# EAGLE schematic Mainboard (EAGLE 7.7.0)
AUTHOR: Eltra EW; DESCRIPION: test; DESCRIPTION: Platine an Schlitten; VERSION: V1.0
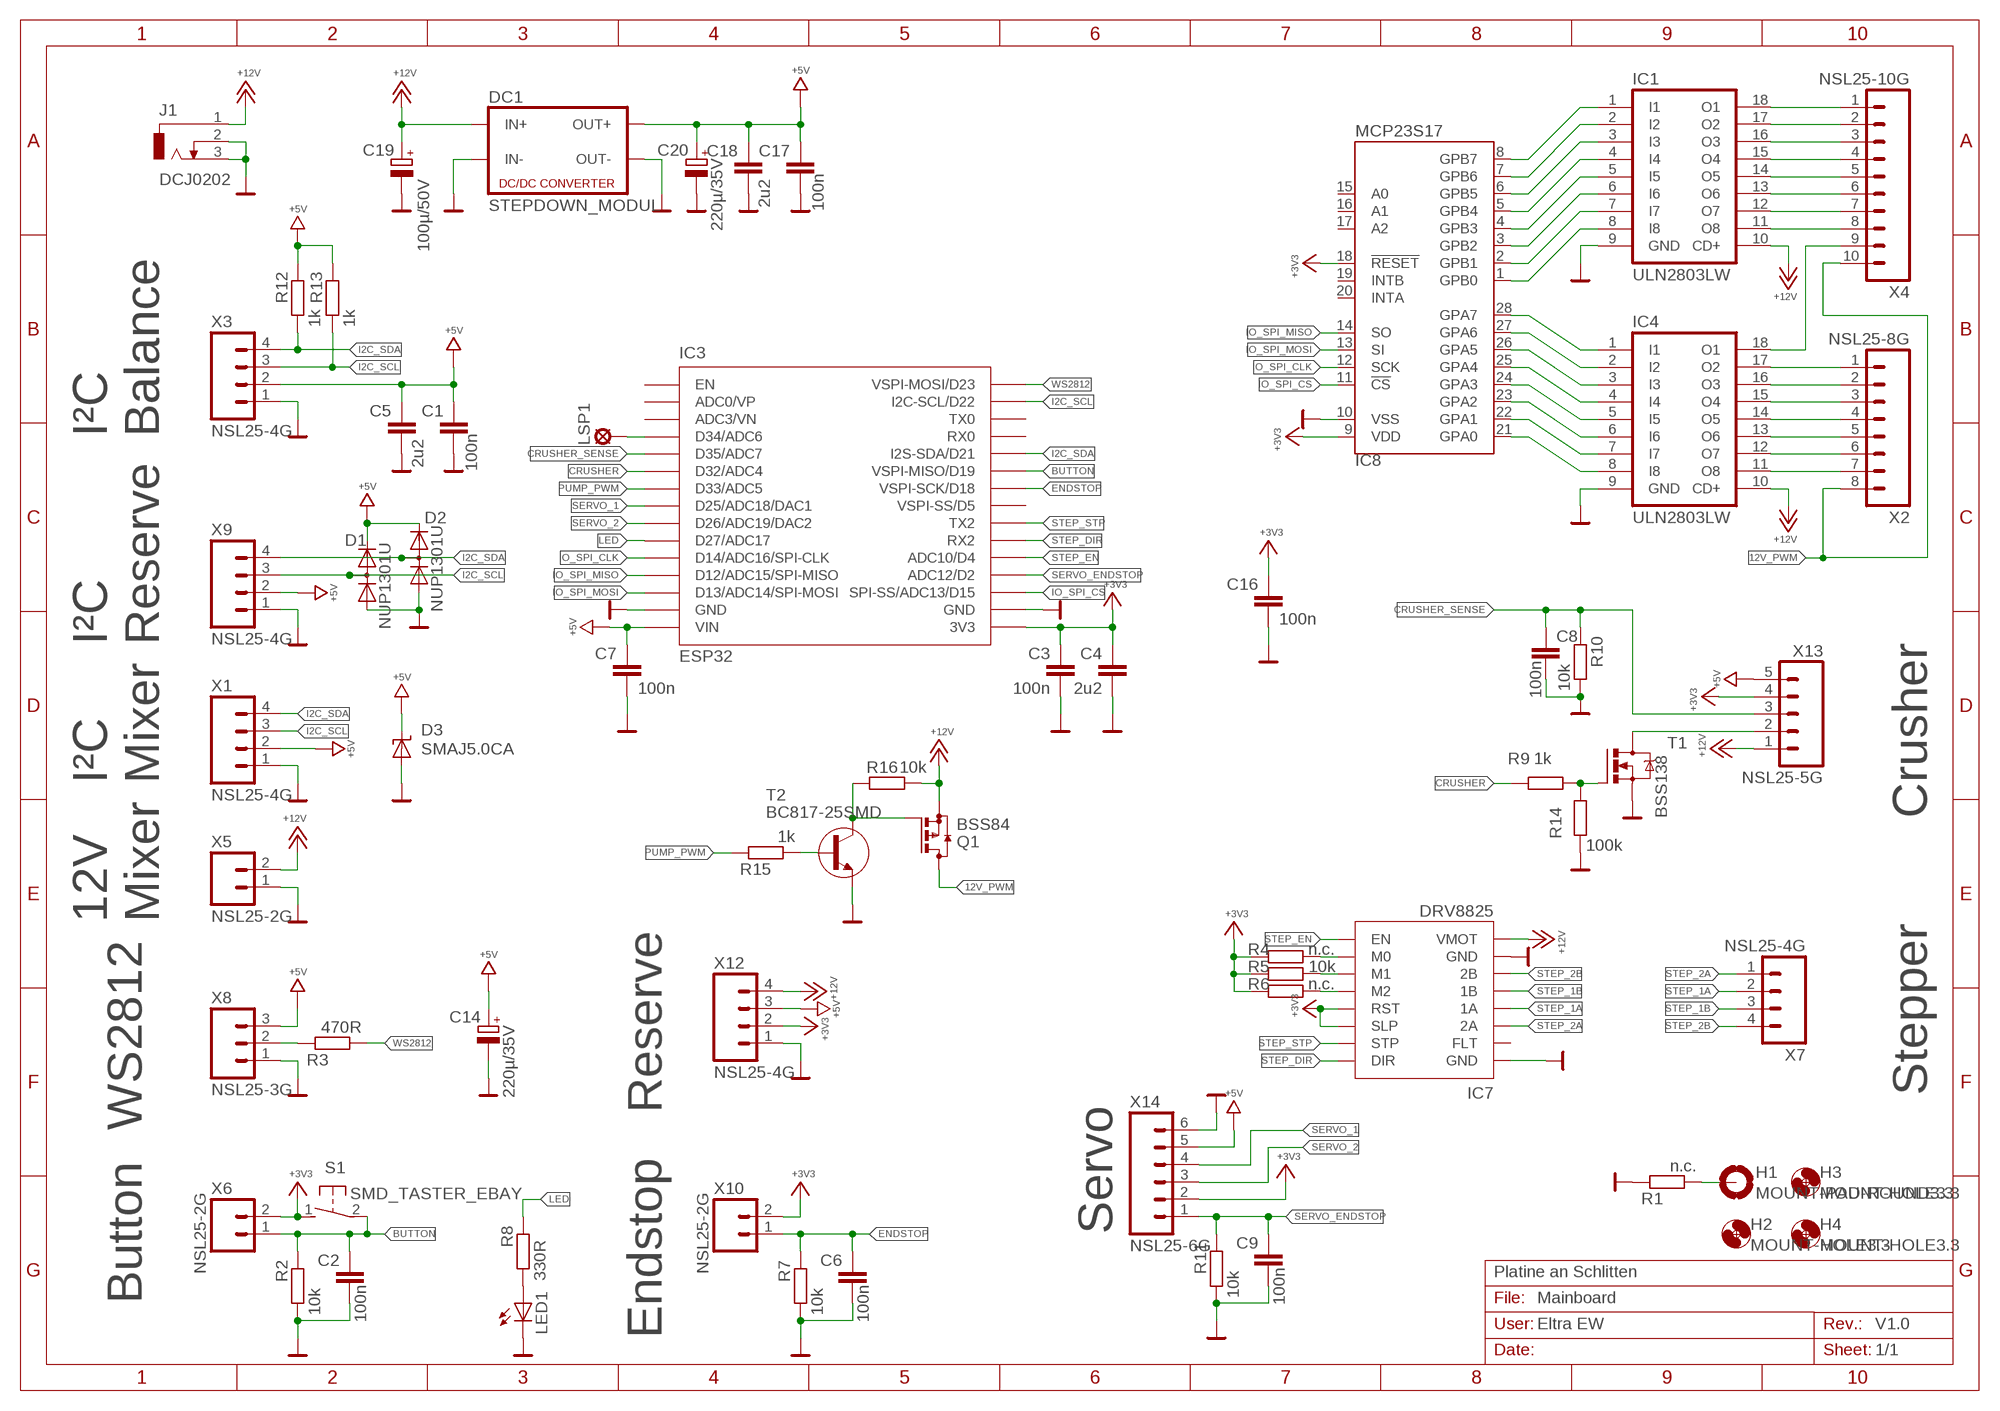
[diagram p0: schematic, sheet 1]

## Parts
C1  100n  C-EUC0805CRH  [0805CRH]
C2  100n  C-EUC0805CRH  [0805CRH]
C3  100n  C-EUC0805CRH  [0805CRH]
C4  2u2  C-EUC0805CRH  [0805CRH]
C5  2u2  C-EUC0805CRH  [0805CRH]
C6  100n  C-EUC0805CRH  [0805CRH]
C7  100n  C-EUC0805CRH  [0805CRH]
C8  100n  C-EUC0805CRH  [0805CRH]
C9  100n  C-EUC0805CRH  [0805CRH]
C14  220µ/35V  CPOL-EU153CLV-1010  [153CLV-1010]
C16  100n  C-EUC0805CRH  [0805CRH]
C17  100n  C-EUC0805CRH  [0805CRH]
C18  2u2  C-EUC0805CRH  [0805CRH]
C19  100µ/50V  CPOL-EU153CLV-1010  [153CLV-1010]
C20  220µ/35V  CPOL-EU153CLV-1010  [153CLV-1010]
D1  NUP1301U  NUP1301U_115  [SOT323-3]
D2  NUP1301U  NUP1301U_115  [SOT323-3]
D3  SMAJ5.0CA  SMAJ  [SMA-DO214AC]
DC1  STEPDOWN_MODUL  [STEPDOWN_MODUL]
H1  MOUNT-PAD-ROUND3.3  [3,3-PAD]
H2  MOUNT-HOLE3.3  [3,3]
H3  MOUNT-HOLE3.3  [3,3]
H4  MOUNT-HOLE3.3  [3,3]
IC1  ULN2803LW  [SO18W]
IC3  ESP32  [ESP32]
IC4  ULN2803LW  [SO18W]
IC7  DRV8825  [DRV8825]
IC8  MCP23S17  [SOIC-28]
J1  DCJ0202  [DCJ0202]
LED1  LEDCHIPLED_0805  [CHIPLED_0805]
LSP1  LSP06  [LSP06]
Q1  BSS84  [SOT23]
R1  n.c.  R-EU_R0805CRH  [0805CRH]
R2  10k  R-EU_R0805CRH  [0805CRH]
R3  470R  R-EU_R0805CRH  [0805CRH]
R4  n.c.  R-EU_R0805CRH  [0805CRH]
R5  10k  R-EU_R0805CRH  [0805CRH]
R6  n.c.  R-EU_R0805CRH  [0805CRH]
R7  10k  R-EU_R0805CRH  [0805CRH]
R8  330R  R-EU_R0805CRH  [0805CRH]
R9  1k  R-EU_R0805CRH  [0805CRH]
R10  10k  R-EU_R0805CRH  [0805CRH]
R11  10k  R-EU_R0805CRH  [0805CRH]
R12  1k  R-EU_R0805CRH  [0805CRH]
R13  1k  R-EU_R0805CRH  [0805CRH]
R14  100k  R-EU_R0805CRH  [0805CRH]
R15  1k  R-EU_R0805CRH  [0805CRH]
R16  10k  R-EU_R0805CRH  [0805CRH]
S1  SMD_TASTER_EBAY  [DTSM3XN]
T1  BSS138  [SOT23]
T2  BC817-25SMD  [SOT23-BEC]
X1  NSL25-4G  [NSL25-4G]
X2  NSL25-8G  [NSL25-8G]
X3  NSL25-4G  [NSL25-4G]
X4  NSL25-10G  [NSL25-10G]
X5  NSL25-2G  [NSL25-2G]
X6  NSL25-2G  [NSL25-2G]
X7  NSL25-4G  [NSL25-4G]
X8  NSL25-3G  [NSL25-3G]
X9  NSL25-4G  [NSL25-4G]
X10  NSL25-2G  [NSL25-2G]
X12  NSL25-4G  [NSL25-4G]
X13  NSL25-5G  [NSL25-5G]
X14  NSL25-6G  [NSL25-6G]

## Nets
12V_PWM: Q1.3(D) X2.8 X4.10
+3V3: C3.1 C4.1 C16.1 IC3.3V3 IC7.RST IC7.SLP IC8.9(VDD) IC8.18(!RESET!) R4.1 R5.1 R6.1 S1.1(S) X6.2 X10.2 X12.2 X13.4 X14.2
+5V: C1.1 C5.1 C7.1 C14.+ C17.1 C18.1 C20.+ D1.2 D2.2 D3.K(C) DC1.OUT+ IC3.VIN R12.1 R13.1 X1.2 X3.2 X8.3 X9.2 X12.3 X13.5 X14.5
+12V: C19.+ DC1.IN+ IC1.10(CD+) IC4.10(CD+) IC7.VMOT J1.1 Q1.2(S) R16.2 X5.2 X12.4 X13.1
BUTTON: C2.1 IC3.D19(VSPI-MISO/D19) R2.1 S1.2(P) X6.1
CRUSHER: IC3.D32(D32/ADC4) R9.1
CRUSHER_SENSE: C8.1 IC3.D35(D35/ADC7) R10.1 X13.3
ENDSTOP: C6.1 IC3.D18(VSPI-SCK/D18) R7.1 X10.1
GND: C1.2 C2.2 C3.2 C4.2 C5.2 C6.2 C7.2 C8.2 C9.2 C14.- C16.2 C17.2 C18.2 C19.- C20.- D1.1 D2.1 D3.A DC1.IN- DC1.OUT- IC1.9(GND) IC3.GND@1(GND) IC3.GND@2(GND) IC4.9(GND) IC7.GND@1(GND) IC7.GND@2(GND) IC8.10(VSS) J1.2 J1.3 LED1.C R1.1 R2.2 R7.2 R10.2 R11.2 R14.1 T1.2(S) T2.E X1.1 X3.1 X5.1 X8.1 X9.1 X12.1 X14.6
I2C_SCL: D1.3 IC3.D22(I2C-SCL/D22) R13.2 X1.3 X3.3 X9.3
I2C_SDA: D2.3 IC3.D21(I2S-SDA/D21) R12.2 X1.4 X3.4 X9.4
IO_SPI_CLK: IC3.D14(D14/ADC16/SPI-CLK) IC8.12(SCK)
IO_SPI_CS: IC3.D15(SPI-SS/ADC13/D15) IC8.11(!CS!)
IO_SPI_MISO: IC3.D12(D12/ADC15/SPI-MISO) IC8.14(SO)
IO_SPI_MOSI: IC3.D13(D13/ADC14/SPI-MOSI) IC8.13(SI)
LED: IC3.D27(D27/ADC17) R8.1
N$4: LED1.A R8.2
N$5: T1.3(D) X13.2
N$6: R9.2 R14.2 T1.1(G)
N$7: Q1.1(G) R16.1 T2.C
N$8: R15.2 T2.B
N$10: IC3.D34(D34/ADC6) LSP1.MP
N$25: R3.1 X8.2
N$28: H1.B3,3(MOUNT) R1.2
N$29: IC4.8(I8) IC8.21(GPA0)
N$31: IC4.7(I7) IC8.22(GPA1)
N$38: IC4.6(I6) IC8.23(GPA2)
N$49: IC4.5(I5) IC8.24(GPA3)
N$50: IC4.4(I4) IC8.25(GPA4)
N$51: IC4.3(I3) IC8.26(GPA5)
N$52: IC4.2(I2) IC8.27(GPA6)
N$53: IC1.18(O1) X4.1
N$54: IC1.17(O2) X4.2
N$55: IC1.16(O3) X4.3
N$56: IC1.15(O4) X4.4
N$57: IC1.14(O5) X4.5
N$58: IC1.13(O6) X4.6
N$59: IC1.12(O7) X4.7
N$60: IC1.11(O8) X4.8
N$61: IC4.18(O1) X4.9
N$62: IC4.17(O2) X2.1
N$63: IC4.16(O3) X2.2
N$64: IC4.15(O4) X2.3
N$65: IC4.14(O5) X2.4
N$66: IC4.13(O6) X2.5
N$67: IC4.12(O7) X2.6
N$68: IC4.11(O8) X2.7
N$71: IC4.1(I1) IC8.28(GPA7)
N$72: IC1.8(I8) IC8.1(GPB0)
N$73: IC7.M0 R4.2
N$74: IC7.M1 R5.2
N$75: IC7.M2 R6.2
N$76: IC1.7(I7) IC8.2(GPB1)
N$77: IC1.6(I6) IC8.3(GPB2)
N$78: IC1.5(I5) IC8.4(GPB3)
N$79: IC1.4(I4) IC8.5(GPB4)
N$80: IC1.3(I3) IC8.6(GPB5)
N$81: IC1.2(I2) IC8.7(GPB6)
N$82: IC1.1(I1) IC8.8(GPB7)
PUMP_PWM: IC3.D33(D33/ADC5) R15.1
SERVO_1: IC3.D25(D25/ADC18/DAC1) X14.4
SERVO_2: IC3.D26(D26/ADC19/DAC2) X14.3
SERVO_ENDSTOP: C9.1 IC3.D2(ADC12/D2) R11.1 X14.1
STEP_1A: IC7.1A X7.2
STEP_1B: IC7.1B X7.3
STEP_2A: IC7.2A X7.1
STEP_2B: IC7.2B X7.4
STEP_DIR: IC3.RX2 IC7.DIR
STEP_EN: IC3.D4(ADC10/D4) IC7.EN
STEP_STP: IC3.TX2 IC7.STP
WS2812: IC3.D23(VSPI-MOSI/D23) R3.2
Unconnected: IC3.D5(VSPI-SS/D5) IC3.EN IC3.RX0 IC3.TX0 IC3.VP(ADC0/VP) IC7.FLT IC8.15(A0) IC8.16(A1) IC8.17(A2) IC8.19(INTB) IC8.20(INTA)

## Notes on the sheet
- I²C
  Balance
- I²C
  Reserve
- I²C
  Mixer
- Crusher
- 12V
  Mixer
- Stepper
- Reserve
- WS2812
- Servo
- Button
- Endstop

## Power pins joined to a net without a drawn wire
ADC3/VN: IC3.VN(ADC3/VN)

## Library data of the parts
C1-C9 C16-C18 = rcl_jci:C-EU: CAPACITOR, European symbol
C14 C19 C20 = rcl_jci:CPOL-EU: POLARIZED CAPACITOR, European symbol
D1 D2 = Diode:NUP1301U_115: ESD-Entstörer/TVS-Dioden, SOT-323-3
D3 = Eltra_Teile:SMAJ: Suppressor diode
DC1 = Powersupply:STEPDOWN_MODUL
H1 = holes_jci:MOUNT-PAD-ROUND: MOUNTING PAD, round
H2-H4 = holes_jci:MOUNT-HOLE: MOUNTING HOLE with drill center marker
IC1 IC4 = uln-udn_jci:ULN2803: DRIVER ARRAY
IC3 = ESP:ESP32
IC7 = Stepper Driver:DRV8825
IC8 = IO-Extender:MCP23S17
J1 = con-jack:DCJ0202: DC POWER JACK Source: DCJ0202.pdf; OC_FARNELL: unknown; OC_NEWARK: unknown
LED1 = led_jci:LED: LED OSRAM: - CHIPLED LG R971, LG N971, LY N971, LG Q971, LY Q971, LO R971, LY R971 LH N974, LH R974 LS Q976, LO Q976, LY Q976 LO Q996 - Hyper CHIPLED LW Q18S LB Q993, LB Q99A, LB R99A - SideLED LS A670, LO A670, LY A670, LG A670, LP A670 LB A673, LV A673, LT A673, LW A673 LH A674 LY A675 LS A676, LA A676, LO A676, LY A676, LW A676 LS A679, LY A679, LG A679 - Hyper Micro SIDELED® LS Y876, LA Y876, LO Y876, LY Y876 LT Y87S - SmartLED LW L88C, LW L88S LB L89C, LB L89S, LG L890 LS L89K, LO L89K, LY L89K LS L896, LA L896, LO L896, LY L896 - TOPLED LS T670, LO T670, LY T670, LG T670, LP T670 LSG T670, LSP T670, LSY T670, LOP T670, LYG T670 LG T671, LOG T671, LSG T671 LB T673, LV T673, LT T673, LW T673 LH T674 LS T676, LA T676, LO T676, LY T676, LB T676, LH T676, LSB T676, LW T676 LB T67C, LV T67C, LT T67C, LS T67K, LO T67K, LY T67K, LW E67C LS E67B, LA E67B, LO E67B, LY E67B, LB E67C, LV E67C, LT E67C LW T67C LS T679, LY T679, LG T679 LS T770, LO T770, LY T770, LG T770, LP T770 LB T773, LV T773, LT T773, LW T773 LH T774 LS E675, LA E675, LY E675, LS T675 LS T776, LA T776, LO T776, LY T776, LB T776 LHGB T686 LT T68C, LB T68C - Hyper Mini TOPLED® LB M676 - Mini TOPLED Santana® LG M470 LS M47K, LO M47K, LY M47K Source: http://www.osram.convergy.de/
LSP1 = solpad_jci:LSP: SOLDER PAD
Q1 = mosfet_jci:BSS84: P-CHANNEL MOS FET
R1-R16 = rcl_jci:R-EU_: RESISTOR, European symbol
S1 = switch:SMD_TASTER_EBAY: Taster Serie DTSM3xN
T1 = mosfet_jci:BSS138: N-Channel MOSFET 50V 0.2A Rds = 3.5R
T2 = transistor_jci:BC817*: NPN Transistor
X1 X3 X7 X9 X12 = con-nsk_jci:NSL25-4: Nylonstiftleiste
X2 = con-nsk_jci:NSL25-8: Nylonstiftleiste
X4 = con-nsk_jci:NSL25-10: Nylonstiftleiste
X5 X6 X10 = con-nsk_jci:NSL25-2: Nylonstiftleiste
X8 = con-nsk_jci:NSL25-3: Nylonstiftleiste
X13 = con-nsk_jci:NSL25-5: Nylonstiftleiste
X14 = con-nsk_jci:NSL25-6: Nylonstiftleiste